# EAGLE design LIC_rack_ZM-01 (EAGLE 7.2.0)
AUTHOR: M. Petrilak; VERSION: 00

## Sheet 1 of 4
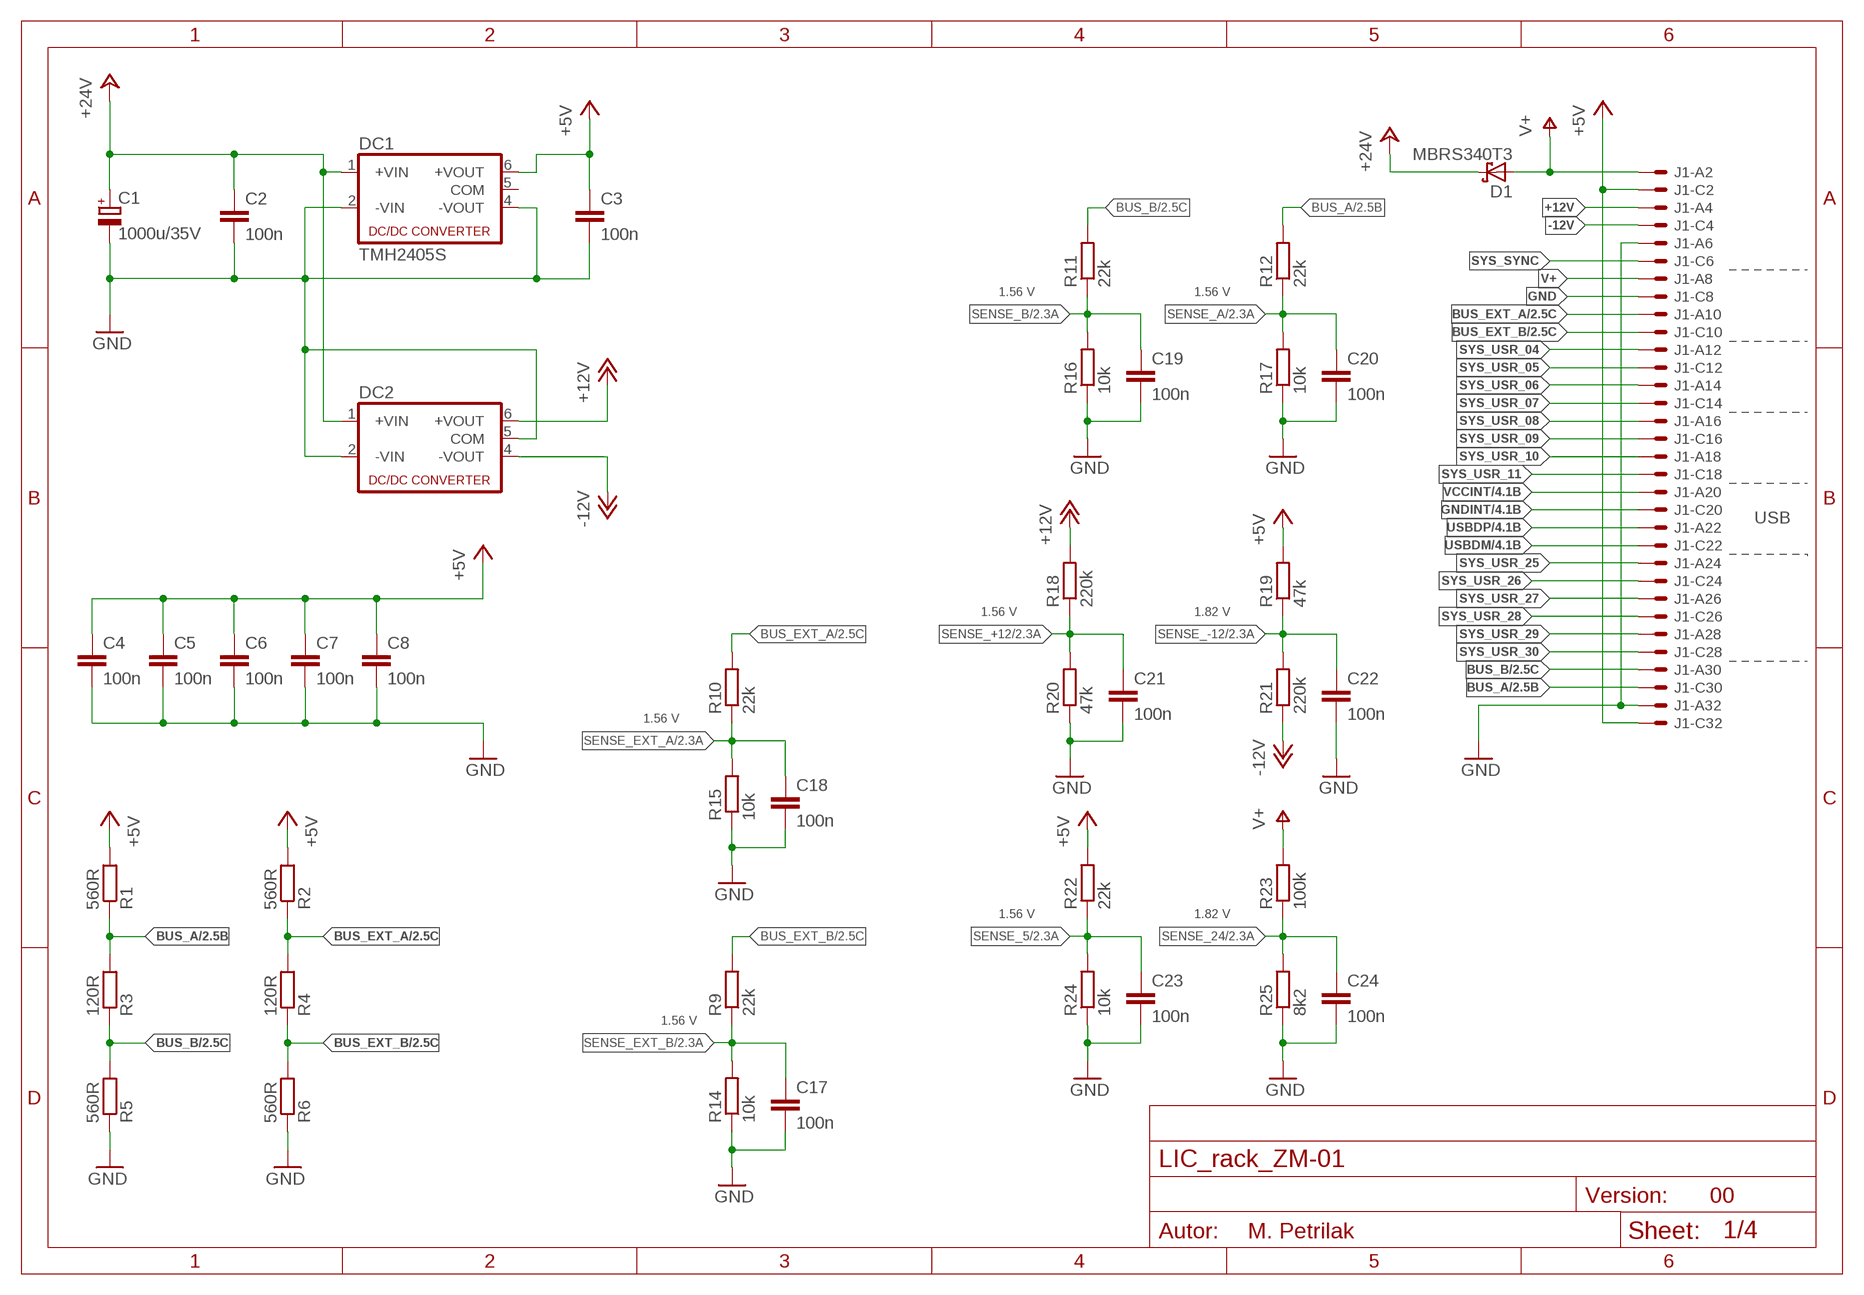
[diagram p0: schematic, sheet 1]

### Parts
C1  1000u/35V  CPOL-EUE5-13X26-LR  [E5-13X26-LR]
C2  100n  C-EUC1206  [C1206]
C3  100n  C-EUC1206  [C1206]
C4  100n  C-EUC1206  [C1206]
C5  100n  C-EUC1206  [C1206]
C6  100n  C-EUC1206  [C1206]
C7  100n  C-EUC1206  [C1206]
C8  100n  C-EUC1206  [C1206]
C17  100n  C-EUC1206  [C1206]
C18  100n  C-EUC1206  [C1206]
C19  100n  C-EUC1206  [C1206]
C20  100n  C-EUC1206  [C1206]
C21  100n  C-EUC1206  [C1206]
C22  100n  C-EUC1206  [C1206]
C23  100n  C-EUC1206  [C1206]
C24  100n  C-EUC1206  [C1206]
D1  MBRS340T3  [SMC]
DC1  TMH2405S  NMA  [NMA]
DC2  NMA  [NMA]
J1  VG32SP  [VG32P]
R1  560R  R-EU_R1206  [R1206]
R2  560R  R-EU_R1206  [R1206]
R3  120R  R-EU_R1206  [R1206]
R4  120R  R-EU_R1206  [R1206]
R5  560R  R-EU_R1206  [R1206]
R6  560R  R-EU_R1206  [R1206]
R9  22k  R-EU_R1206  [R1206]
R10  22k  R-EU_R1206  [R1206]
R11  22k  R-EU_R1206  [R1206]
R12  22k  R-EU_R1206  [R1206]
R14  10k  R-EU_R1206  [R1206]
R15  10k  R-EU_R1206  [R1206]
R16  10k  R-EU_R1206  [R1206]
R17  10k  R-EU_R1206  [R1206]
R18  220k  R-EU_R1206  [R1206]
R19  47k  R-EU_R1206  [R1206]
R20  47k  R-EU_R1206  [R1206]
R21  220k  R-EU_R1206  [R1206]
R22  22k  R-EU_R1206  [R1206]
R23  100k  R-EU_R1206  [R1206]
R24  10k  R-EU_R1206  [R1206]
R25  8k2  R-EU_R1206  [R1206]

### Nets
+5V: C3.1 C4.1 C5.1 C6.1 C7.1 C8.1 DC1.6(+VOUT) J1.C2 J1.C32 R1.2 R2.2 R19.2 R22.2 ; also sheet 2,3,4
+12V: DC2.6(+VOUT) J1.A4 R18.2
+24V: C1.+ C2.1 D1.C DC1.1(+VIN) DC2.1(+VIN)
-12V: DC2.4(-VOUT) J1.C4 R21.1
BUS_A: J1.C30 R1.1 R3.2 R12.2 ; also sheet 2
BUS_B: J1.A30 R3.1 R5.2 R11.2 ; also sheet 2
BUS_EXT_A: J1.A10 R2.1 R4.2 R10.2 ; also sheet 2
BUS_EXT_B: J1.C10 R4.1 R6.2 R9.2 ; also sheet 2
GND: C1.- C2.2 C3.2 C4.2 C5.2 C6.2 C7.2 C8.2 C17.2 C18.2 C19.2 C20.2 C21.2 C22.2 C23.2 C24.2 DC1.2(-VIN) DC1.4(-VOUT) DC2.2(-VIN) DC2.5(COM) J1.A6 J1.A32 J1.C8 R5.1 R6.1 R14.1 R15.1 R16.1 R17.1 R20.1 R24.1 R25.1 ; also sheet 2,3,4
GNDINT [PC]: J1.C20 ; also sheet 4
SENSE_5: C23.1 R22.1 R24.2 ; also sheet 2
SENSE_24: C24.1 R23.1 R25.2 ; also sheet 2
SENSE_+12: C21.1 R18.1 R20.2 ; also sheet 2
SENSE_-12: C22.1 R19.1 R21.2 ; also sheet 2
SENSE_A: C20.1 R12.1 R17.2 ; also sheet 2
SENSE_B: C19.1 R11.1 R16.2 ; also sheet 2
SENSE_EXT_A: C18.1 R10.1 R15.2 ; also sheet 2
SENSE_EXT_B: C17.1 R9.1 R14.2 ; also sheet 2
SYS_SYNC: J1.C6
SYS_USR_04: J1.A12
SYS_USR_05: J1.C12
SYS_USR_06: J1.A14
SYS_USR_07: J1.C14
SYS_USR_08: J1.A16
SYS_USR_09: J1.C16
SYS_USR_10: J1.A18
SYS_USR_11 [PC]: J1.C18
SYS_USR_25: J1.A24
SYS_USR_26 [PC]: J1.C24
SYS_USR_27: J1.A26
SYS_USR_28 [PC]: J1.C26
SYS_USR_29: J1.A28
SYS_USR_30: J1.C28
USBDM [PC]: J1.C22 ; also sheet 4
USBDP [PC]: J1.A22 ; also sheet 4
V+: D1.A J1.A2 J1.A8 R23.2
VCCINT [PC]: J1.A20 ; also sheet 4
Unconnected: DC1.5(COM)

### Notes on the sheet
- 1.56 V | 1.56 V
- USB
- 1.56 V | 1.82 V
- 1.56 V
- 1.56 V | 1.82 V
- 1.56 V

## Sheet 2 of 4
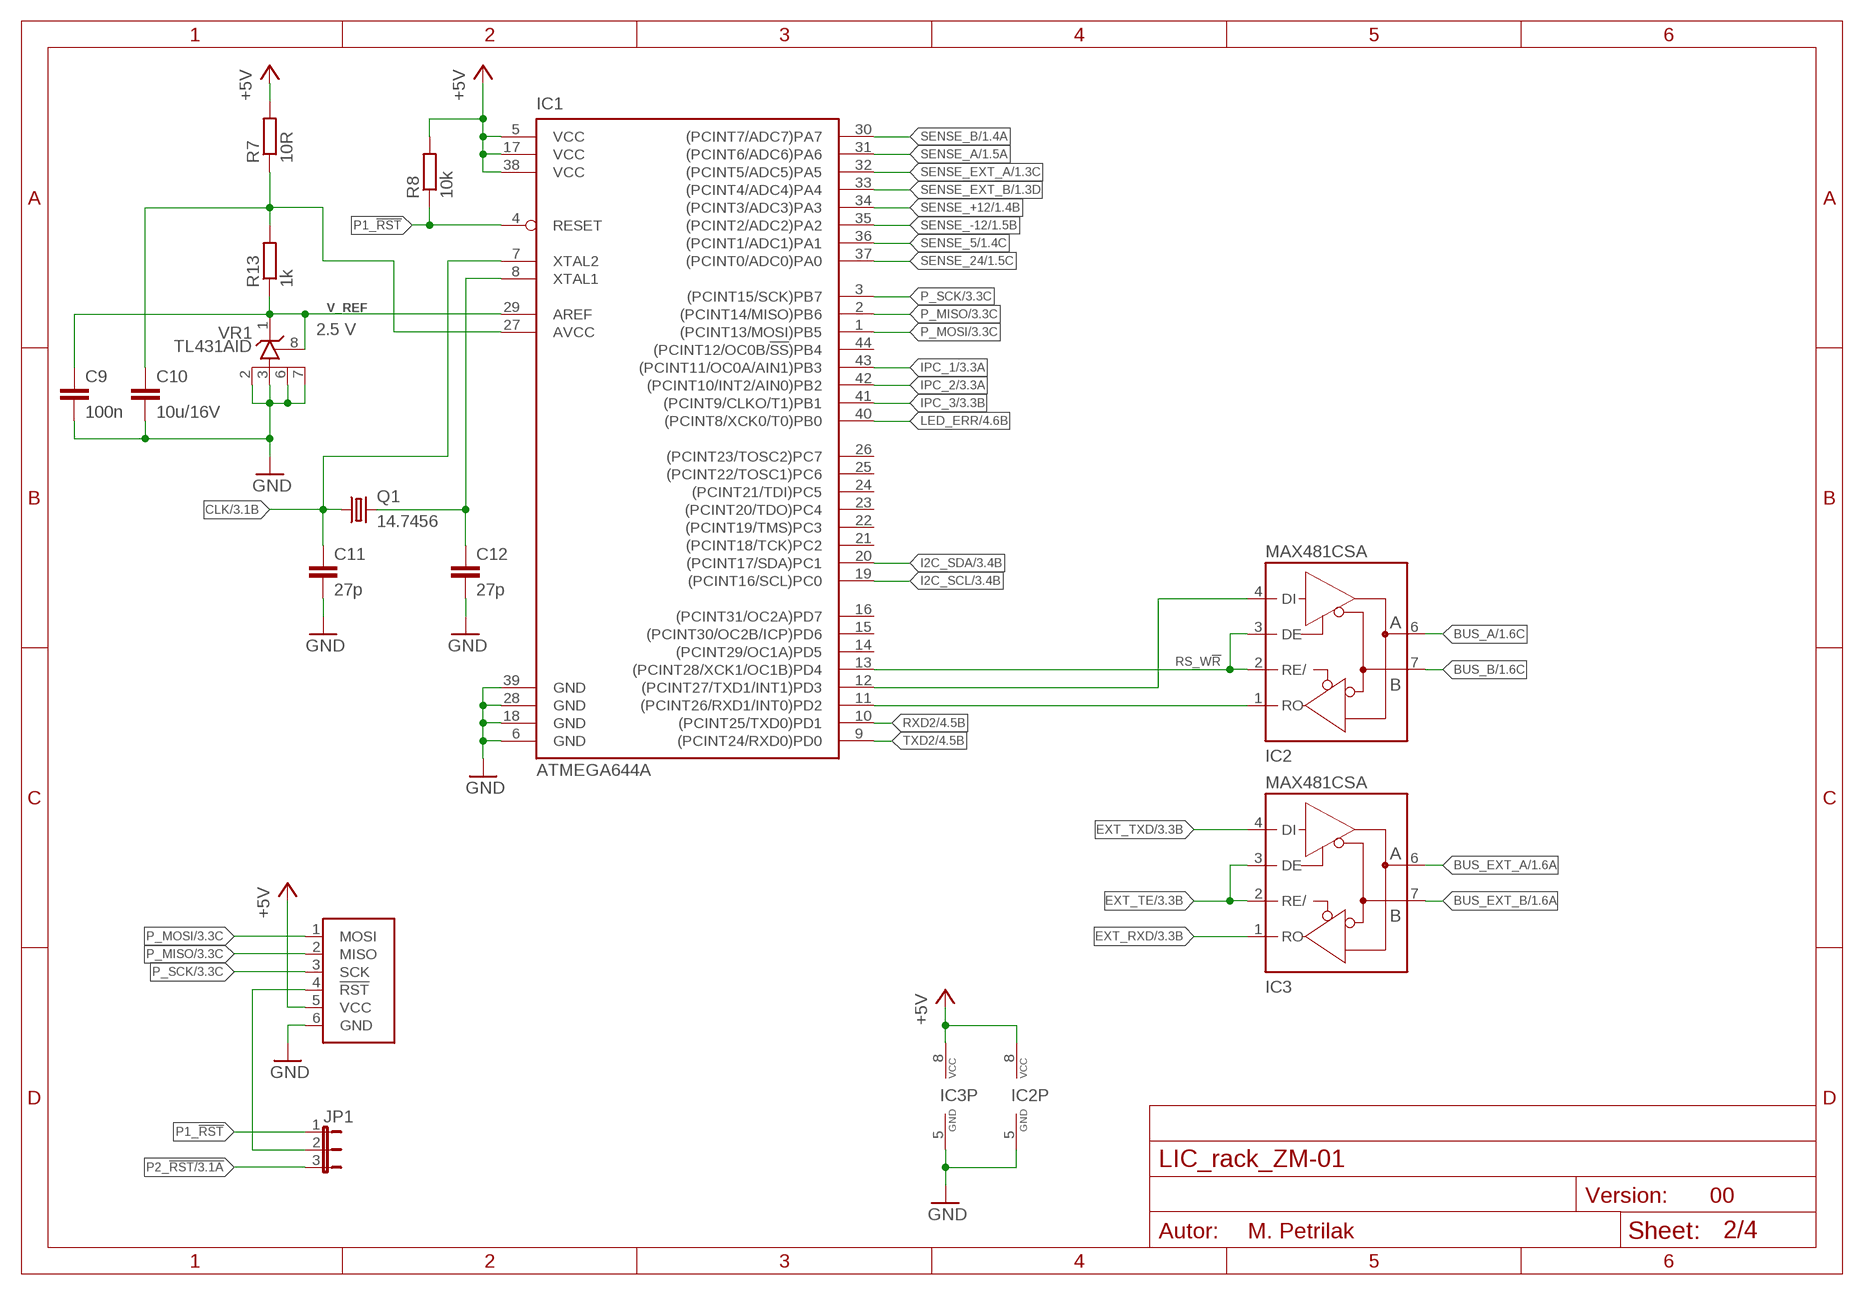
[diagram p1: schematic, sheet 2]

### Parts
C9  100n  C-EUC1206  [C1206]
C10  10u/16V  C-EUC1206  [C1206]
C11  27p  C-EUC0805  [C0805]
C12  27p  C-EUC0805  [C0805]
IC1  ATMEGA644A  [TQFP44]
IC2  MAX481CSA  [SO08]
IC3  MAX481CSA  [SO08]
JP1  JP2E  [JP2]
Q1  14.7456  XTAL  [HC49U70]
R7  10R  R-EU_R1206  [R1206]
R8  10k  R-EU_R1206  [R1206]
R13  1k  R-EU_R1206  [R1206]
U1  ATPROG-V  [6410-06]
VR1  TL431AID  TL431-SMD  [SO-08]

### Nets
!RST: JP1.2 U1.4(!RST)
+5V: IC1.5(VCC) IC1.17(VCC) IC1.38(VCC) IC2.8(VCC) IC3.8(VCC) R7.2 R8.2 U1.5(VCC) ; also sheet 1,3,4
+5V_AD: C10.1 IC1.27(AVCC) R7.1 R13.2
BUS_A: IC2.6(A) ; also sheet 1
BUS_B: IC2.7(B) ; also sheet 1
BUS_EXT_A: IC3.6(A) ; also sheet 1
BUS_EXT_B: IC3.7(B) ; also sheet 1
CLK: C11.1 IC1.7(XTAL2) Q1.1 ; also sheet 3
EXT_RXD: IC3.1(RO) ; also sheet 3
EXT_TE: IC3.2(RE/) IC3.3(DE) ; also sheet 3
EXT_TXD: IC3.4(DI) ; also sheet 3
GND: C9.2 C10.2 C11.2 C12.2 IC1.6(GND) IC1.18(GND) IC1.28(GND) IC1.39(GND) IC2.5(GND) IC3.5(GND) U1.6(GND) VR1.2(A3) VR1.3(A2) VR1.6(A1) VR1.7(A) ; also sheet 1,3,4
I2C_SCL: IC1.19((PCINT16/SCL)PC0) ; also sheet 3
I2C_SDA: IC1.20((PCINT17/SDA)PC1) ; also sheet 3
IPC_1: IC1.43((PCINT11/OC0A/AIN1)PB3) ; also sheet 3
IPC_2: IC1.42((PCINT10/INT2/AIN0)PB2) ; also sheet 3
IPC_3: IC1.41((PCINT9/CLKO/T1)PB1) ; also sheet 3
LED_ERR: IC1.40((PCINT8/XCK0/T0)PB0) ; also sheet 4
N$2: C12.1 IC1.8(XTAL1) Q1.2
P1_!RST: IC1.4(RESET) JP1.1 R8.1
P2_!RST: JP1.3 ; also sheet 3
P_MISO: IC1.2((PCINT14/MISO)PB6) U1.2(MISO) ; also sheet 3
P_MOSI: IC1.1((PCINT13/MOSI)PB5) U1.1(MOSI) ; also sheet 3
P_SCK: IC1.3((PCINT15/SCK)PB7) U1.3(SCK) ; also sheet 3
RS_RXD: IC1.11((PCINT26/RXD1/INT0)PD2) IC2.1(RO)
RS_TXD: IC1.12((PCINT27/TXD1/INT1)PD3) IC2.4(DI)
RS_W!R!: IC1.13((PCINT28/XCK1/OC1B)PD4) IC2.2(RE/) IC2.3(DE)
RXD2: IC1.10((PCINT25/TXD0)PD1) ; also sheet 4
SENSE_5: IC1.36((PCINT1/ADC1)PA1) ; also sheet 1
SENSE_24: IC1.37((PCINT0/ADC0)PA0) ; also sheet 1
SENSE_+12: IC1.34((PCINT3/ADC3)PA3) ; also sheet 1
SENSE_-12: IC1.35((PCINT2/ADC2)PA2) ; also sheet 1
SENSE_A: IC1.31((PCINT6/ADC6)PA6) ; also sheet 1
SENSE_B: IC1.30((PCINT7/ADC7)PA7) ; also sheet 1
SENSE_EXT_A: IC1.32((PCINT5/ADC5)PA5) ; also sheet 1
SENSE_EXT_B: IC1.33((PCINT4/ADC4)PA4) ; also sheet 1
TXD2: IC1.9((PCINT24/RXD0)PD0) ; also sheet 4
V_REF: C9.1 IC1.29(AREF) R13.1 VR1.1(C) VR1.8(R)
Unconnected: IC1.14((PCINT29/OC1A)PD5) IC1.15((PCINT30/OC2B/ICP)PD6) IC1.16((PCINT31/OC2A)PD7) IC1.21((PCINT18/TCK)PC2) IC1.22((PCINT19/TMS)PC3) IC1.23((PCINT20/TDO)PC4) IC1.24((PCINT21/TDI)PC5) IC1.25((PCINT22/TOSC1)PC6) IC1.26((PCINT23/TOSC2)PC7) IC1.44((PCINT12/OC0B/!SS!)PB4)

### Notes on the sheet
- 2.5 V

## Sheet 3 of 4
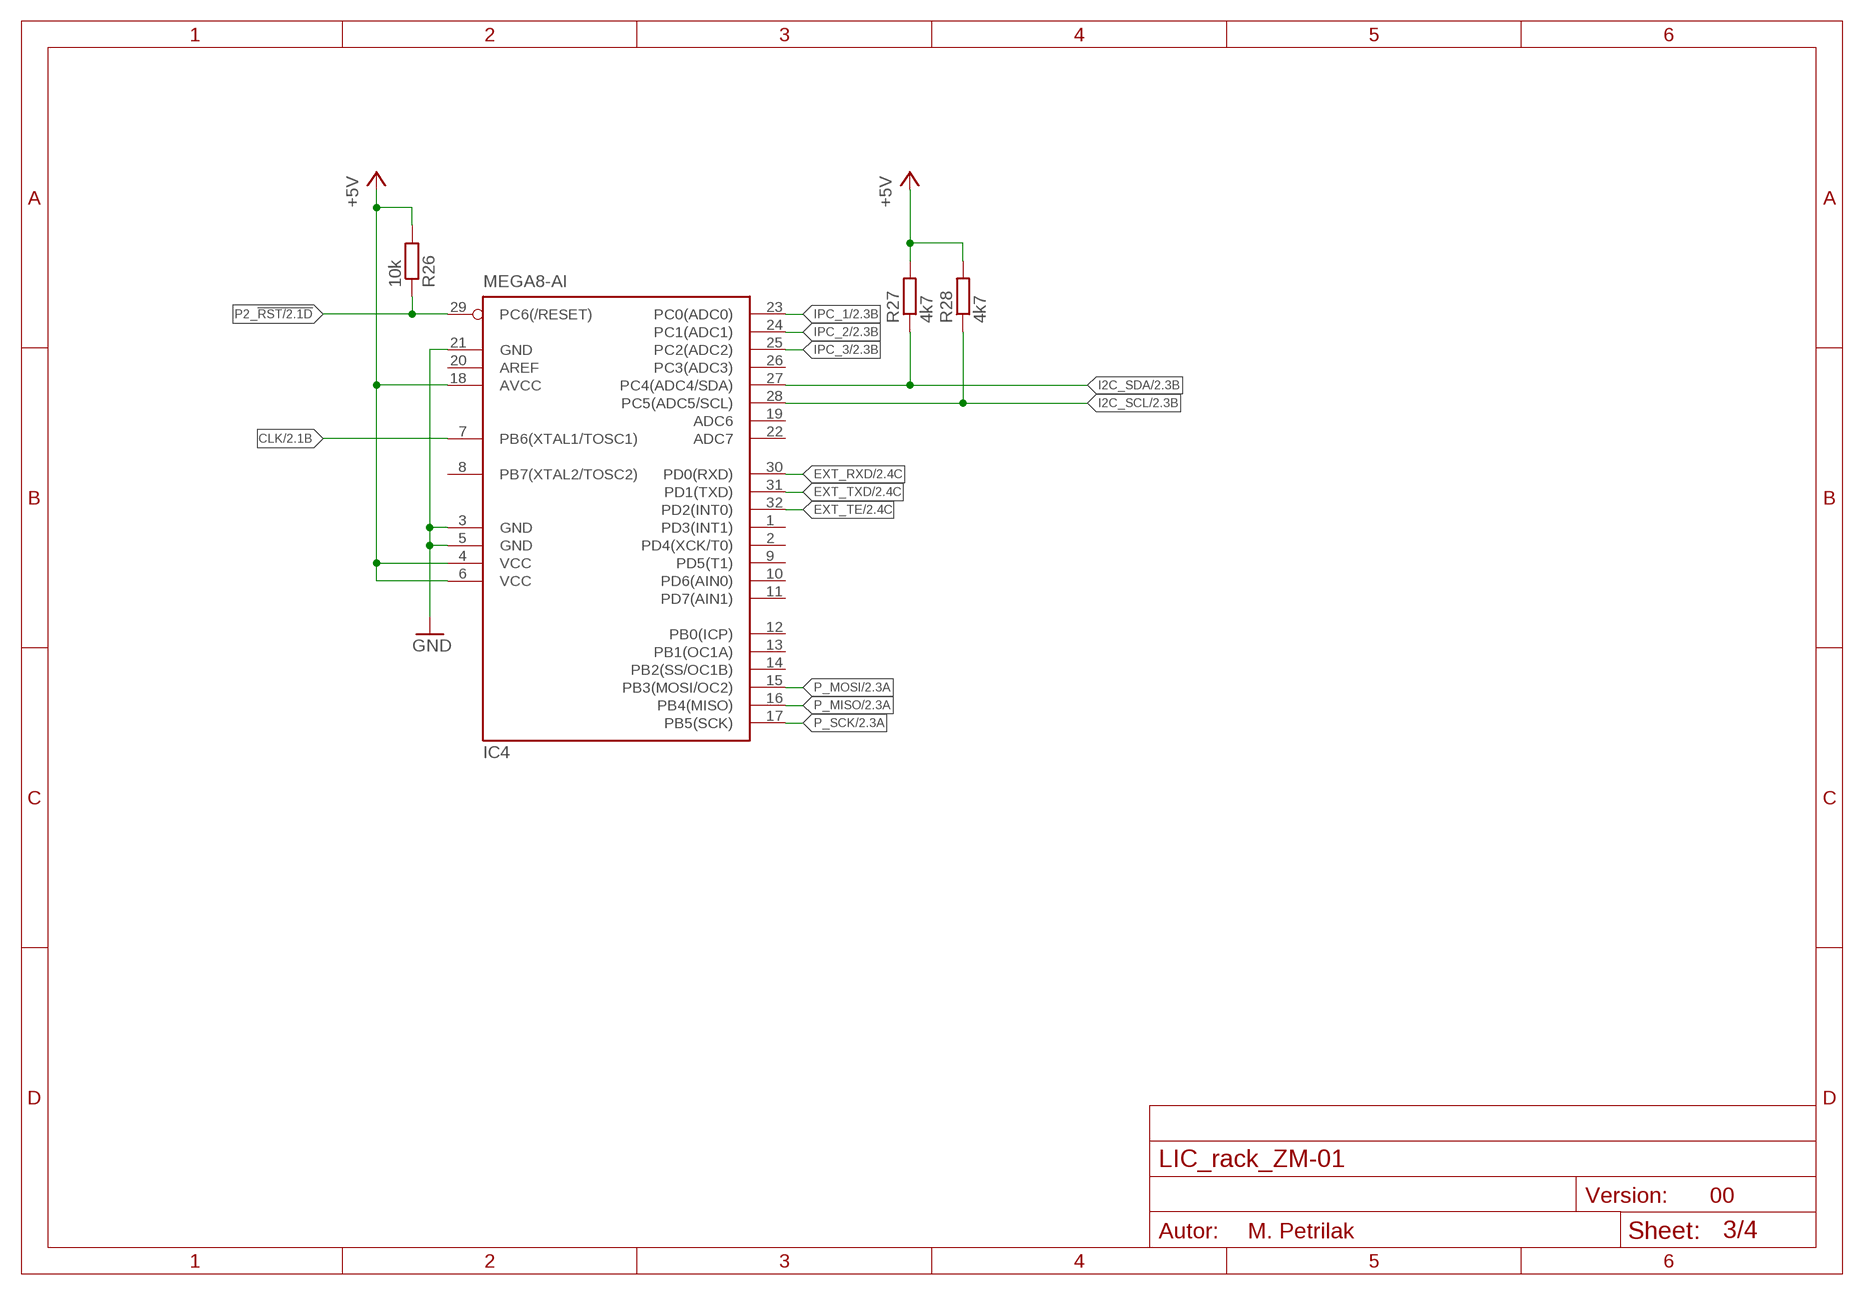
[diagram p2: schematic, sheet 3]

### Parts
IC4  MEGA8-AI  [TQFP32-08]
R26  10k  R-EU_R1206  [R1206]
R27  4k7  R-EU_R1206  [R1206]
R28  4k7  R-EU_R1206  [R1206]

### Nets
+5V: IC4.4(VCC) IC4.6(VCC) IC4.18(AVCC) R26.2 R27.2 R28.2 ; also sheet 1,2,4
CLK: IC4.7(PB6(XTAL1/TOSC1)) ; also sheet 2
EXT_RXD: IC4.30(PD0(RXD)) ; also sheet 2
EXT_TE: IC4.32(PD2(INT0)) ; also sheet 2
EXT_TXD: IC4.31(PD1(TXD)) ; also sheet 2
GND: IC4.3(GND) IC4.5(GND) IC4.21(GND) ; also sheet 1,2,4
I2C_SCL: IC4.28(PC5(ADC5/SCL)) R28.1 ; also sheet 2
I2C_SDA: IC4.27(PC4(ADC4/SDA)) R27.1 ; also sheet 2
IPC_1: IC4.23(PC0(ADC0)) ; also sheet 2
IPC_2: IC4.24(PC1(ADC1)) ; also sheet 2
IPC_3: IC4.25(PC2(ADC2)) ; also sheet 2
P2_!RST: IC4.29(PC6(/RESET)) R26.1 ; also sheet 2
P_MISO: IC4.16(PB4(MISO)) ; also sheet 2
P_MOSI: IC4.15(PB3(MOSI/OC2)) ; also sheet 2
P_SCK: IC4.17(PB5(SCK)) ; also sheet 2
Unconnected: IC4.1(PD3(INT1)) IC4.2(PD4(XCK/T0)) IC4.8(PB7(XTAL2/TOSC2)) IC4.9(PD5(T1)) IC4.10(PD6(AIN0)) IC4.11(PD7(AIN1)) IC4.12(PB0(ICP)) IC4.13(PB1(OC1A)) IC4.14(PB2(SS/OC1B)) IC4.19(ADC6) IC4.20(AREF) IC4.22(ADC7) IC4.26(PC3(ADC3))

## Sheet 4 of 4
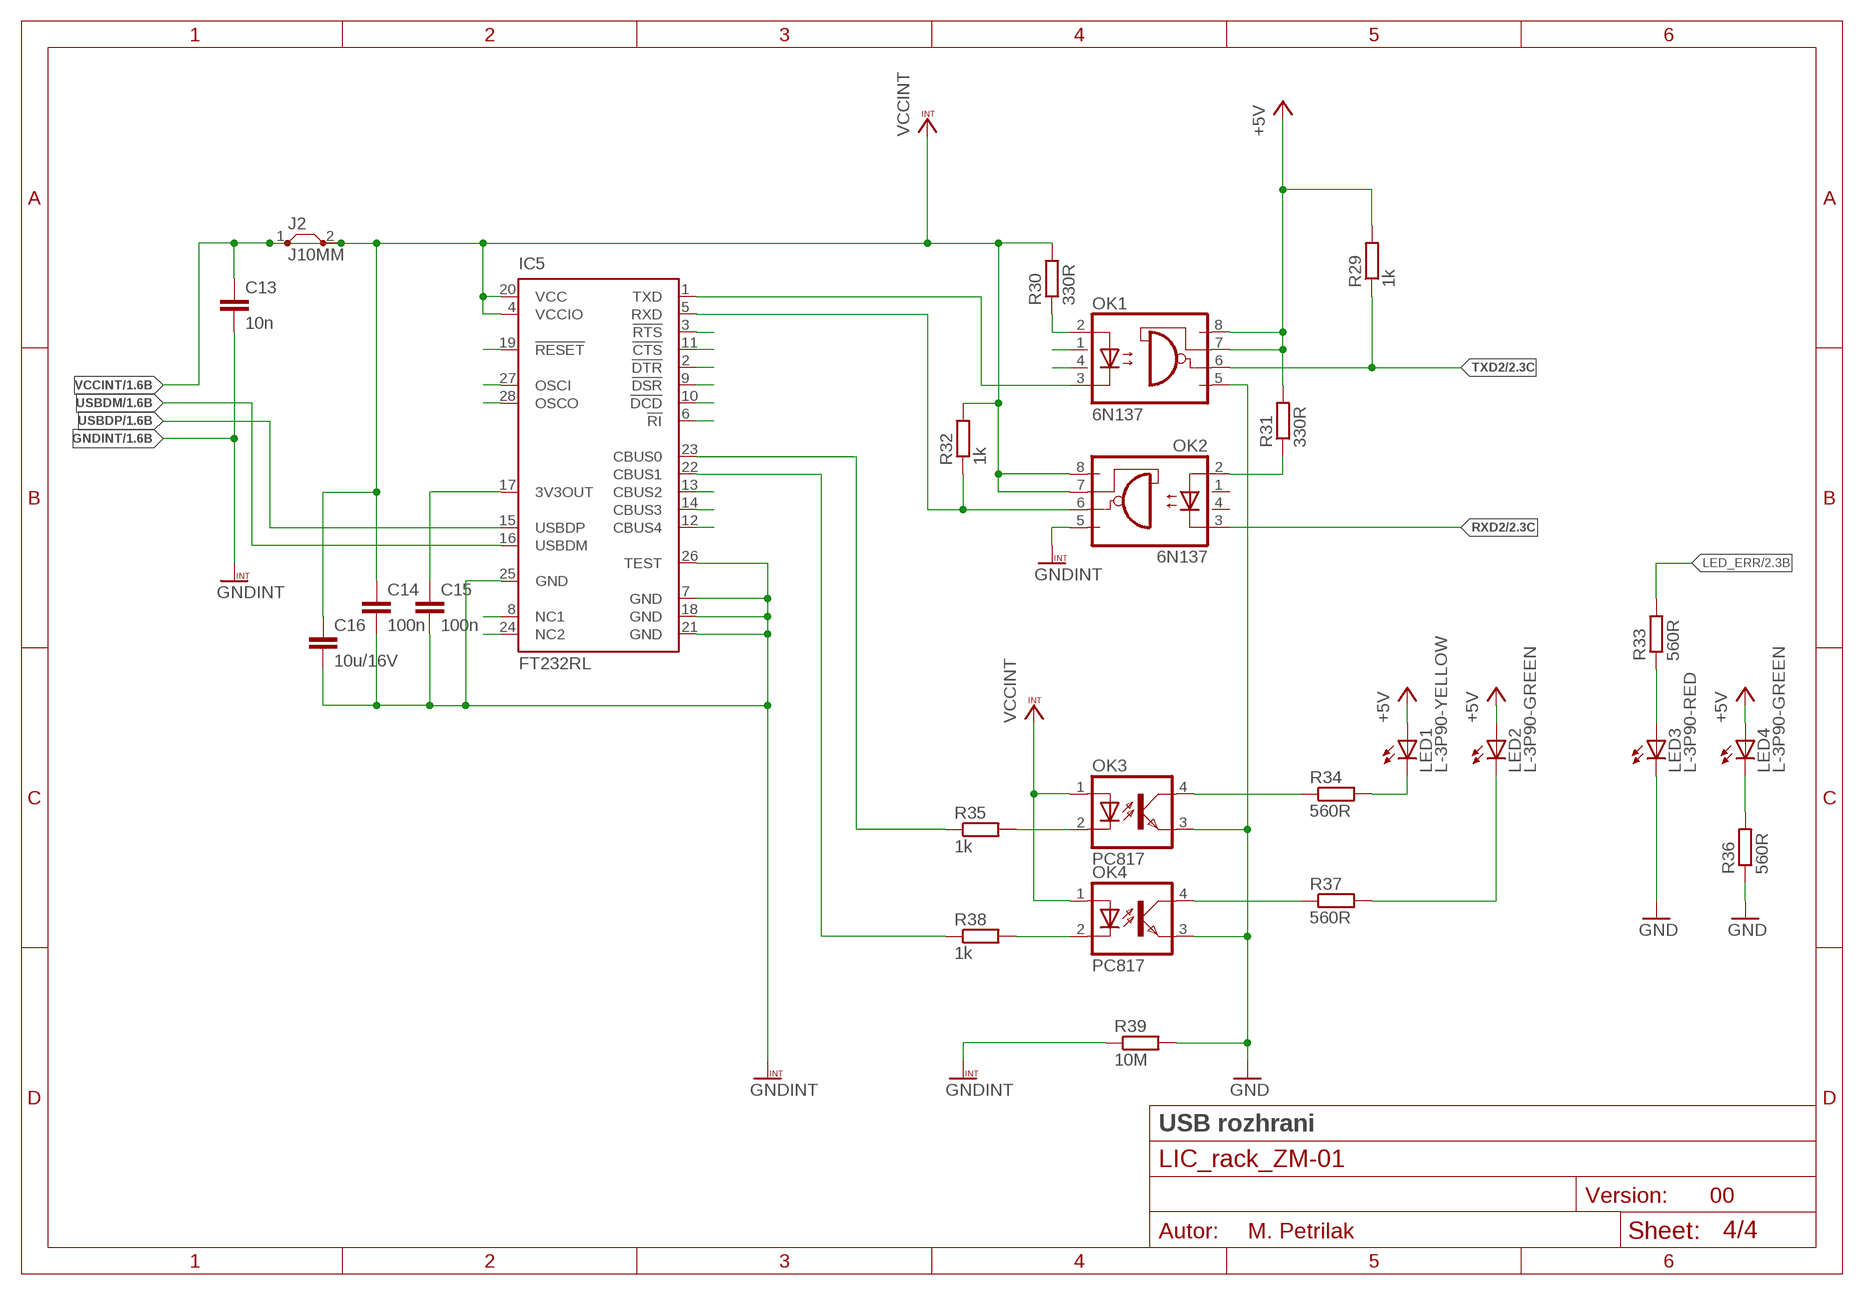
[diagram p3: schematic, sheet 4]

### Parts
C13  10n  C-EUC0805  [C0805]
C14  100n  C-EUC1206  [C1206]
C15  100n  C-EUC1206  [C1206]
C16  10u/16V  C-EUC1206  [C1206]
IC5  FT232RL  [SSOP28]
J2  J10MM  [10]
LED1  L-3P90-YELLOW  [L-3P90]
LED2  L-3P90-GREEN  [L-3P90]
LED3  L-3P90-RED  [L-3P90]
LED4  L-3P90-GREEN  [L-3P90]
OK1  6N137  [DIL08]
OK2  6N137  [DIL08]
OK3  PC817  [DIL04]
OK4  PC817  [DIL04]
R29  1k  R-EU_R1206  [R1206]
R30  330R  R-EU_R1206  [R1206]
R31  330R  R-EU_R1206  [R1206]
R32  1k  R-EU_R1206  [R1206]
R33  560R  R-EU_R1206  [R1206]
R34  560R  R-EU_R1206  [R1206]
R35  1k  R-EU_R1206  [R1206]
R36  560R  R-EU_R1206  [R1206]
R37  560R  R-EU_R1206  [R1206]
R38  1k  R-EU_R1206  [R1206]
R39  10M  R-EU_R1206  [R1206]

### Nets
3V3 [PC]: C15.1 IC5.17(3V3OUT)
+5V: LED1.A LED2.A LED4.A OK1.7(VE) OK1.8(VCC) R29.2 R31.2 ; also sheet 1,2,3
GND: LED3.K(C) OK1.5(GND) OK3.3(EMIT) OK4.3(EMIT) R36.1 R39.2 ; also sheet 1,2,3
GNDINT [PC]: C13.2 C14.2 C15.2 C16.2 IC5.7(GND) IC5.18(GND) IC5.21(GND) IC5.25(GND) IC5.26(TEST) OK2.5(GND) R39.1 ; also sheet 1
LED_ERR: R33.2 ; also sheet 2
N$1: LED4.K(C) R36.2
N$3 [PC]: IC5.22(CBUS1) R38.1
N$4 [PC]: IC5.14(CBUS3)
N$6 [PC]: OK4.2(C) R38.2
N$7 [PC]: OK3.2(C) R35.2
N$9: LED3.A R33.1
N$12 [PC]: IC5.19(!RESET)
N$13: OK2.2(A) R31.1
N$16: OK4.4(COL) R37.1
N$17: LED2.K(C) R37.2
N$21 [PC]: OK1.2(A) R30.1
N$23: OK3.4(COL) R34.1
N$24 [PC]: IC5.23(CBUS0) R35.1
N$25 [PC]: IC5.27(OSCI)
N$26: LED1.K(C) R34.2
N$29 [PC]: IC5.28(OSCO)
N$30 [PC]: IC5.3(!RTS)
N$31 [PC]: IC5.11(!CTS)
N$32 [PC]: IC5.2(!DTR)
N$33 [PC]: IC5.9(!DSR)
N$34 [PC]: IC5.10(!DCD)
N$35 [PC]: IC5.6(!RI)
N$36 [PC]: IC5.12(CBUS4)
N$37 [PC]: IC5.13(CBUS2)
N$38 [PC]: IC5.8(NC1)
N$39 [PC]: IC5.24(NC2)
N$42 [PC]: OK1.1(A1)
N$43 [PC]: OK1.4(A2)
RXD1 [PC]: IC5.5(RXD) OK2.6(VO) R32.1
RXD2: OK2.3(C) ; also sheet 2
TXD1 [PC]: IC5.1(TXD) OK1.3(C)
TXD2: OK1.6(VO) R29.1 ; also sheet 2
USBDM [PC]: IC5.16(USBDM) ; also sheet 1
USBDP [PC]: IC5.15(USBDP) ; also sheet 1
VCCINT [PC]: C13.1 C14.1 C16.1 IC5.4(VCCIO) IC5.20(VCC) J2.1 J2.2 OK2.7(VE) OK2.8(VCC) OK3.1(A) OK4.1(A) R30.2 R32.2 ; also sheet 1
Unconnected: OK2.1(A1) OK2.4(A2)

### Notes on the sheet
- USB rozhrani

## Library data of the parts
C1 = rcl:CPOL-EU: POLARIZED CAPACITOR, European symbol
C2-C24 = rcl:C-EU: CAPACITOR, European symbol
D1 = diode:MBRS340T3
DC1 DC2 = dc-dc-converter:NMA: DC-DC CONVERTER
IC1 = atmel:ATMEGA644: 8-bit Microcontroller with 64K Bytes In-System Programmable Flash Source: http://www.atmel.com/dyn/resources/prod_documents/doc2593.pdf
IC2 IC3 = maxim:MAX481CSA: RS485 TRANSEIVER
IC4 = atmel:MEGA8: MICROCONTROLLER 8 Kbytes FLASH, 1 kbytes SRAM, 512 bytes EEPROM, USART, 6-channel 10 bit ADC, 2-channel 8 bit ADC Pin compatible with Atmega48, ATMega88, ATMega168 Source: avr.lbr
IC5 = ftdichip:FT232R: Source: http://www.ftdichip.com/Documents/DataSheets/DS_FT232R_v104.pdf
J1 = 19inch:VG32S: PCB EUROCARD, 32-pin type C/AC, 5.08 mm
J2 = jumper:J: Bridge
JP1 = jumper:JP2E: JUMPER
LED1-LED4 = led:L-3P90
OK1 OK2 = optocoupler:6N137: MOTOROLA OPTO COUPLER
OK3 OK4 = optocoupler:PC817: SHARP OPTO COUPLER
Q1 = crystal:XTAL
R1-R39 = rcl:R-EU_: RESISTOR, European symbol
U1 = con-molex:ATPROG
VR1 = v-reg:TL431-SMD

## Net classes
1 PC: clearance 2 mm to class 0

## Board
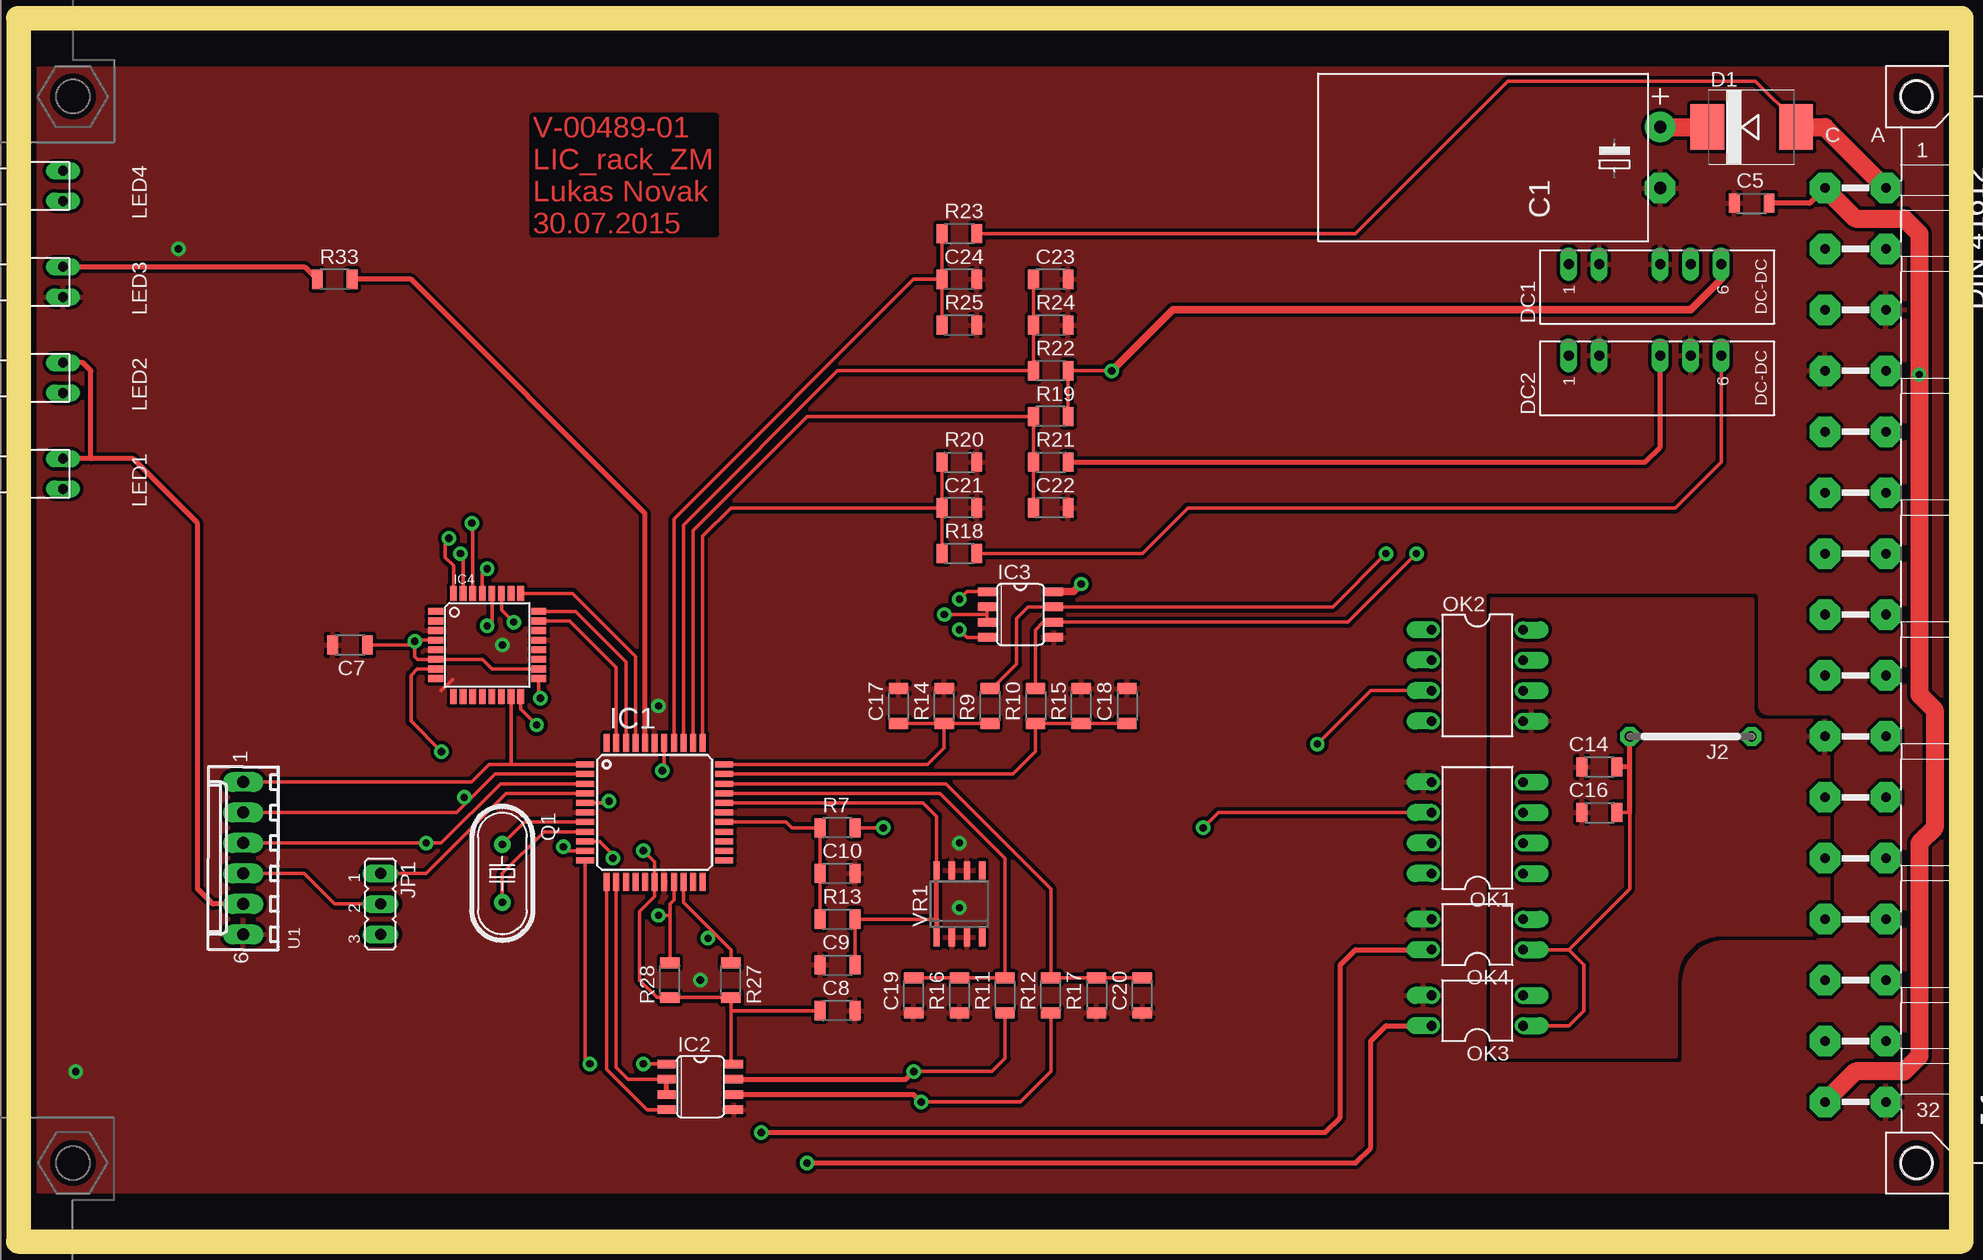
[diagram p4: board, top side]
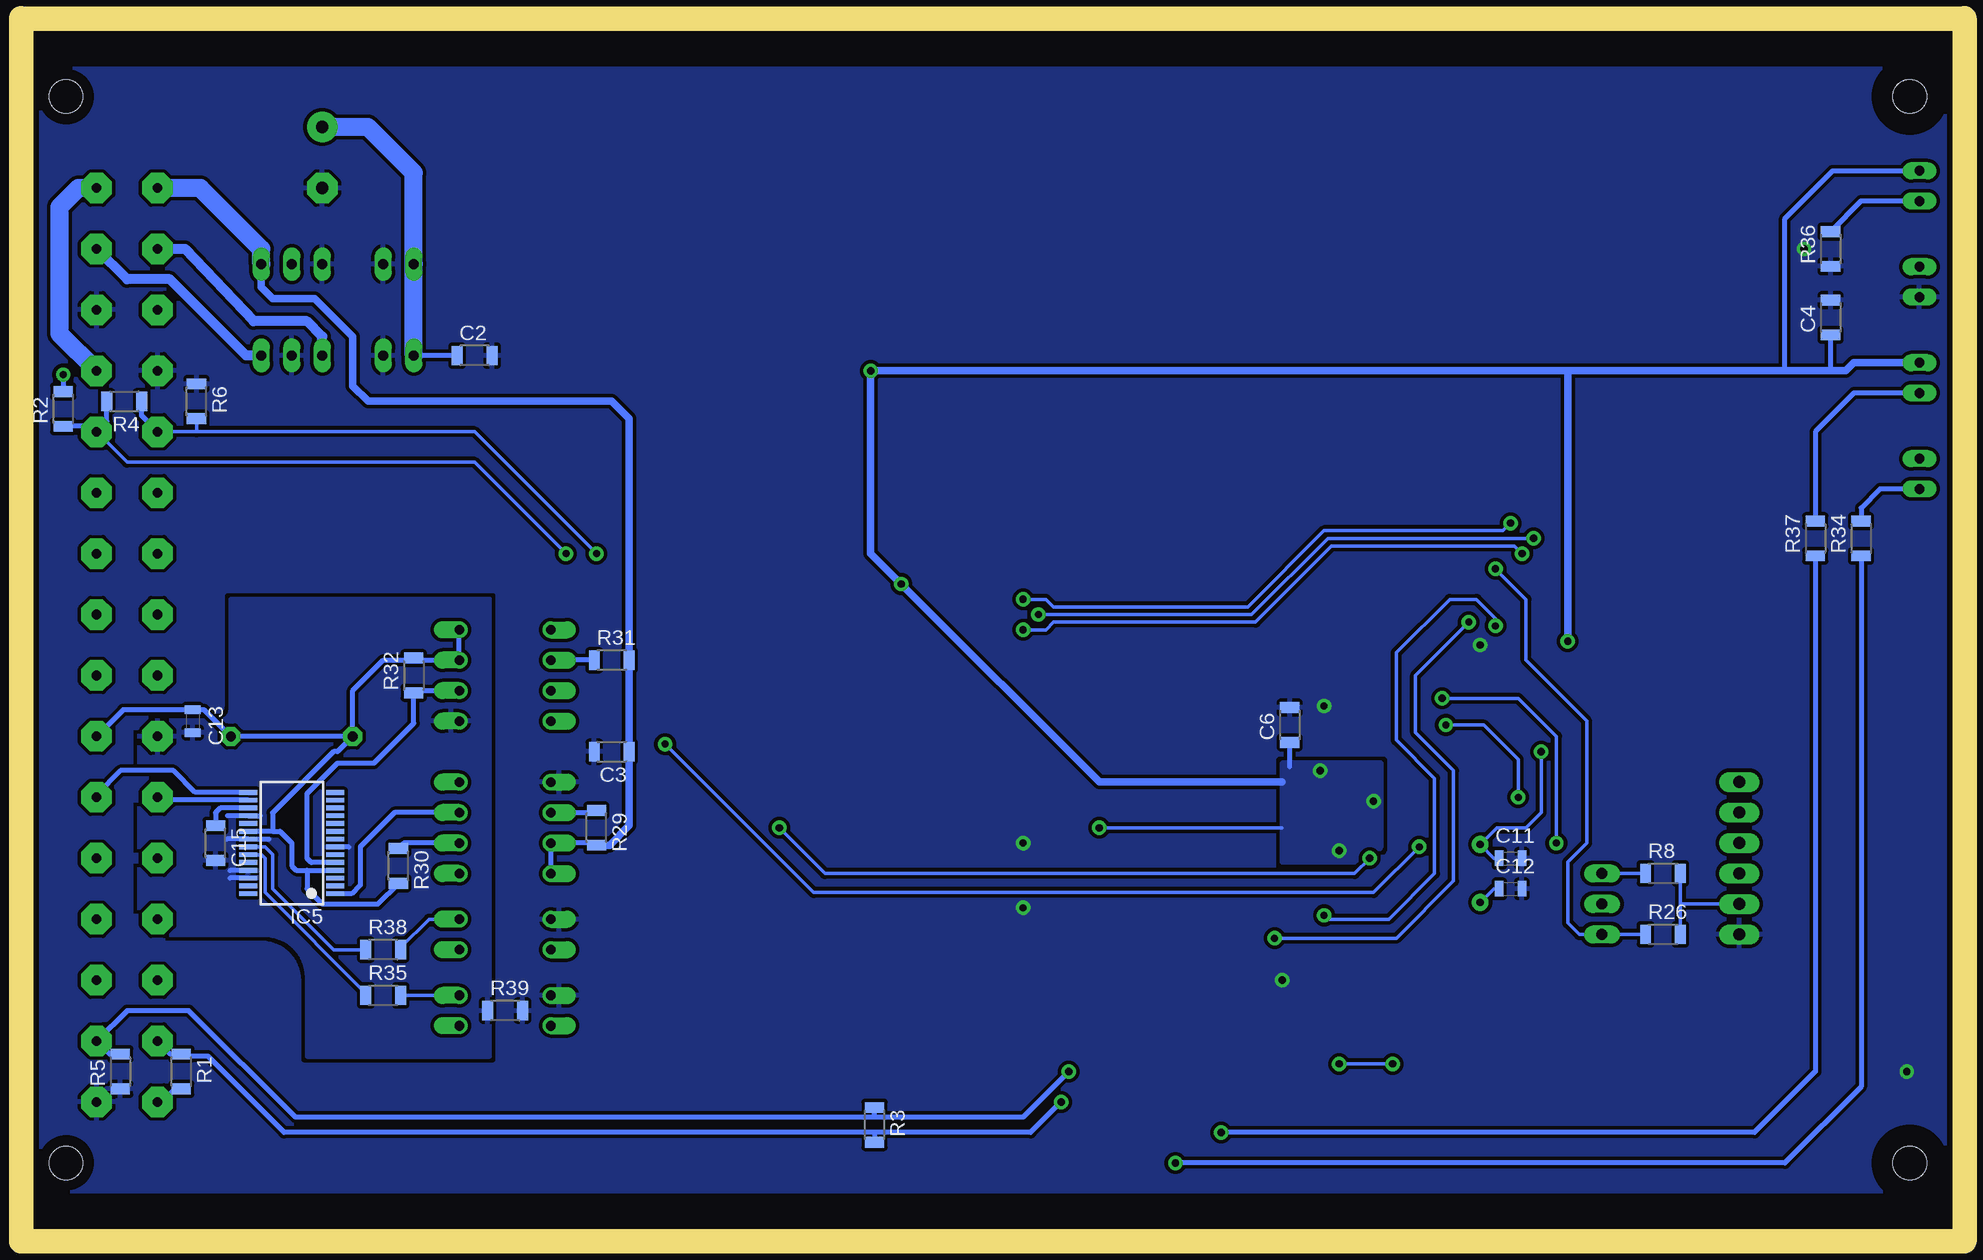
[diagram p5: board, bottom side, seen from below]

Size 160 x 100 mm. Coordinates in mm from the lower left corner, seen from the top.
Copper layers (1*16): Top 0.04mm / dielectric 1.5mm / Bottom 0.04mm
Design rules "mucha_navrh": minimum track width 0.2mm, minimum drill 0.6mm, track to track 0.3mm, track to pad 0.3mm, pad to pad 0.3mm, via to via 0.3mm, smd to smd 0mil, copper to edge 0.5mm, drill to drill 0.5mm, minimum pad ring 0.3mm, minimum via ring 0.3mm, stop-mask expansion 0.1mm, vias tented up to drill 0.5mm, thermal gap 0.3mm

### Footprints (pad centres in the part's own frame; a part is rotated, then mirrored left to right if it is on the bottom)
E5-13X26-LR = drill 1.016 pad 2.54: + -2.54,0 | drill 1.016 pad 2.54 octagon: - 2.54,0
C1206 = smd 0.9 x 1.6: 1 -1.45,0; 2 1.45,0
C0805 = smd 0.7 x 1.3: 1 -0.95,0; 2 0.95,0
SMC = smd 2.8 x 3.8: A 3.7,0; C -3.7,0
NMA = drill 0.813 long: 1 0,6.35; 2 0,3.81; 4 0,-1.27; 5 0,-3.81; 6 0,-6.35
TQFP44 = smd 1.5 x 0.5: 1 -5.8,4; 2 -5.8,3.2; 3 -5.8,2.4; 4 -5.8,1.6; 5 -5.8,0.8; 6 -5.8,0; 7 -5.8,-0.8; 8 -5.8,-1.6; 9 -5.8,-2.4; 10 -5.8,-3.2; 11 -5.8,-4; 23 5.8,-4; 24 5.8,-3.2; 25 5.8,-2.4; 26 5.8,-1.6; 27 5.8,-0.8; 28 5.8,0; 29 5.8,0.8; 30 5.8,1.6; 31 5.8,2.4; 32 5.8,3.2; 33 5.8,4 | smd 0.5 x 1.5: 12 -4,-5.8; 13 -3.2,-5.8; 14 -2.4,-5.8; 15 -1.6,-5.8; 16 -0.8,-5.8; 17 0,-5.8; 18 0.8,-5.8; 19 1.6,-5.8; 20 2.4,-5.8; 21 3.2,-5.8; 22 4,-5.8; 34 4,5.8; 35 3.2,5.8; 36 2.4,5.8; 37 1.6,5.8; 38 0.8,5.8; 39 0,5.8; 40 -0.8,5.8; 41 -1.6,5.8; 42 -2.4,5.8; 43 -3.2,5.8; 44 -4,5.8
SO08 = smd 0.72 x 1.5: 1 -1.905,-2.8; 2 -0.635,-2.8; 3 0.635,-2.8; 4 1.905,-2.8; 5 1.905,2.8; 6 0.635,2.8; 7 -0.635,2.8; 8 -1.905,2.8
TQFP32-08 = smd 1.27 x 0.559: 1 -4.293,2.8; 2 -4.293,2; 3 -4.293,1.2; 4 -4.293,0.4; 5 -4.293,-0.4; 6 -4.293,-1.2; 7 -4.293,-2; 8 -4.293,-2.8; 17 4.293,-2.8; 18 4.293,-2; 19 4.293,-1.2; 20 4.293,-0.4; 21 4.293,0.4; 22 4.293,1.2; 23 4.293,2; 24 4.293,2.8 | smd 0.559 x 1.27: 9 -2.8,-4.293; 10 -2,-4.293; 11 -1.2,-4.293; 12 -0.4,-4.293; 13 0.4,-4.293; 14 1.2,-4.293; 15 2,-4.293; 16 2.8,-4.293; 25 2.8,4.293; 26 2,4.293; 27 1.2,4.293; 28 0.4,4.293; 29 -0.4,4.293; 30 -1.2,4.293; 31 -2,4.293; 32 -2.8,4.293
SSOP28 = smd 0.4 x 1.5: 1 -4.225,-3.625; 2 -3.575,-3.625; 3 -2.925,-3.625; 4 -2.275,-3.625; 5 -1.625,-3.625; 6 -0.975,-3.625; 7 -0.325,-3.625; 8 0.325,-3.625; 9 0.975,-3.625; 10 1.625,-3.625; 11 2.275,-3.625; 12 2.925,-3.625; 13 3.575,-3.625; 14 4.225,-3.625; 15 4.225,3.625; 16 3.575,3.625; 17 2.925,3.625; 18 2.275,3.625; 19 1.625,3.625; 20 0.975,3.625; 21 0.325,3.625; 22 -0.325,3.625; 23 -0.975,3.625; 24 -1.625,3.625; 25 -2.275,3.625; 26 -2.925,3.625; 27 -3.575,3.625; 28 -4.225,3.625
VG32P = drill 0.8 pad 2.54 octagon: A2 154.7,36.83; A4 154.7,31.75; A6 154.7,26.67; A8 154.7,21.59; A10 154.7,16.51; A12 154.7,11.43; A14 154.7,6.35; A16 154.7,1.27; A18 154.7,-3.81; A20 154.7,-8.89; A22 154.7,-13.97; A24 154.7,-19.05; A26 154.7,-24.13; A28 154.7,-29.21; A30 154.7,-34.29; A32 154.7,-39.37; C2 149.62,36.83; C4 149.62,31.75; C6 149.62,26.67; C8 149.62,21.59; C10 149.62,16.51; C12 149.62,11.43; C14 149.62,6.35; C16 149.62,1.27; C18 149.62,-3.81; C20 149.62,-8.89; C22 149.62,-13.97; C24 149.62,-19.05; C26 149.62,-24.13; C28 149.62,-29.21; C30 149.62,-34.29; C32 149.62,-39.37 | hole 2.794: 3.57,44.45; 3.57,-44.45; 157.24,44.45; 157.24,-44.45; 3.57,44.45; 3.57,-44.45; 157.24,44.45; 157.24,-44.45
10 = drill 0.813 pad 1.6 octagon: 1 -5.08,0; 2 5.08,0
JP2 = drill 0.914 long: 1 -2.54,0; 2 0,0; 3 2.54,0
L-3P90 = drill 0.813 long: A 4.7,1.27; K 4.7,-1.27
DIL08 = drill 0.8 pad 1.4 offset: 1 -3.81,-3.81; 2 -1.27,-3.81; 3 1.27,-3.81; 4 3.81,-3.81; 5 3.81,3.81; 6 1.27,3.81; 7 -1.27,3.81; 8 -3.81,3.81
DIL04 = drill 0.8 pad 1.4 offset: 1 -1.27,-3.81; 2 1.27,-3.81; 3 1.27,3.81; 4 -1.27,3.81
HC49U70 = drill 0.6 pad 1.4: 1 -2.413,0; 2 2.413,0
R1206 = smd 0.9 x 1.6: 1 -1.45,0; 2 1.45,0
6410-06 = drill 1.016 long: 1 6.35,0; 2 3.81,0; 3 1.27,0; 4 -1.27,0; 5 -3.81,0; 6 -6.35,0
SO-08 = smd 0.53 x 1.5: 1 -1.905,-2.8; 2 -0.635,-2.8; 3 0.635,-2.8; 4 1.905,-2.8; 5 1.905,2.8; 6 0.635,2.8; 7 -0.635,2.8; 8 -1.905,2.8

### Placement (x,y rotation side)
C1  135.89,89.37 270 top
C2  123.19,72.86 0 bottom
C3  111.76,39.84 180 bottom
C4  10.16,76.03 90 bottom
C5  143.51,85.56 180 top
C6  55.24,42.06 90 bottom
C7  26.67,48.73 180 top
C8  67.31,18.25 0 top
C9  67.31,22.06 180 top
C10  67.31,29.68 0 top
C11  36.83,30.95 0 bottom
C12  36.83,28.41 0 bottom
C13  146.69,42.38 270 bottom
C14  130.81,38.57 180 top
C15  144.78,32.22 270 bottom
C16  130.81,34.76 180 top
C17  72.39,43.65 90 top
C18  91.44,43.65 90 top
C19  73.66,19.52 270 top
C20  92.71,19.52 270 top
C21  77.47,60.16 0 top
C22  85.09,60.16 0 top
C23  85.09,79.21 0 top
C24  77.47,79.21 0 top
D1  143.51,91.91 0 top
DC1  134.62,80.48 90 top
DC2  134.62,72.86 90 top
IC1  52.07,34.76 0 top
IC2  55.88,11.9 270 top
IC3  82.55,51.27 270 top
IC4  38.1,48.73 0 top
IC5  138.43,32.22 90 bottom
J1  0,50 0 top
J2  138.43,41.11 180 top
JP1  29.21,27.14 270 top
LED1  -1.94,63 0 top
LED2  -1.94,71 0 top
LED3  -1.94,79 0 top
LED4  -1.94,87 0 top
OK1  120.65,33.49 90 top
OK2  120.65,46.19 270 top
OK3  120.65,18.25 90 top
OK4  120.65,24.6 90 top
Q1  39.37,29.68 270 top
R1  147.64,13.17 270 bottom
R2  157.48,68.41 90 bottom
R3  89.85,8.73 270 bottom
R4  152.4,69.05 180 bottom
R5  152.72,13.17 90 bottom
R6  146.37,69.05 270 bottom
R7  67.31,33.49 0 top
R8  24.13,29.68 0 bottom
R9  80.01,43.65 90 top
R10  83.82,43.65 90 top
R11  81.28,19.52 270 top
R12  85.09,19.52 270 top
R13  67.31,25.87 180 top
R14  76.2,43.65 270 top
R15  87.63,43.65 270 top
R16  77.47,19.52 90 top
R17  88.9,19.52 90 top
R18  77.47,56.35 0 top
R19  85.09,67.78 0 top
R20  77.47,63.97 180 top
R21  85.09,63.97 180 top
R22  85.09,71.59 0 top
R23  77.47,83.02 0 top
R24  85.09,75.4 180 top
R25  77.47,75.4 180 top
R26  24.13,24.6 0 bottom
R27  58.42,20.79 270 top
R28  53.34,20.79 270 top
R29  113.03,33.49 270 bottom
R30  129.54,30.32 270 bottom
R31  111.76,47.46 0 bottom
R32  128.27,46.19 90 bottom
R33  25.4,79.21 0 top
R34  7.62,57.62 90 bottom
R35  130.81,19.52 0 bottom
R36  10.16,81.75 90 bottom
R37  11.43,57.62 90 bottom
R38  130.81,23.33 0 bottom
R39  120.65,18.25 0 bottom
U1  17.78,30.95 90 top
VR1  77.47,27.14 0 top

### Tracks (layer width: path | path; a pad name or v marks a point on that pad's centre or on a via)
3V3
  Bottom 0.406: IC5.17 144.4,35.14 144.78,34.76 C15.1
!RST
  Top 0.305: U1.4 22.86,29.68 25.4,27.14 JP1.2
+5V  (via drill 0.6)
  Top 0.305: IC1.5 48.11,35.56 v48.26,35.71 | v52.7,38.25 52.87,38.42 IC1.38 | v51.12,31.59 52.07,30.63 IC1.17 52.07,27.77 50.8,26.5 50.8,20.79 52.25,19.34 R28.2 R27.2 58.42,18.25 | R19.2 R22.2 v90.17,71.59 | IC4.4 32.15,49.13 v32.07,49.05 | v32.07,49.05 32.07,47.78 32.31,47.53 IC4.6 37.71,47.53 38.51,46.73 IC4.18 | 58.42,18.25 58.42,14.06 IC2.8 | C7.1 31.75,48.73 v32.07,49.05 | v71.12,33.49 R7.2 | 58.42,18.25 C8.1
  Top 0.406: 5.08,64.27 8.59,64.27 13.97,58.89 13.97,28.41 15.24,27.14 U1.5 | 5.08,64.27 LED1.A | C5.1 148.35,85.56 J1.C2 | LED2.A 4.4,72.27 5.08,71.59 5.08,64.27
  Top 0.61: DC1.6 140.97,79.21 138.43,76.67 95.25,76.67 v90.17,71.59 | IC3.8 87,53.17 v87.63,53.81
  Top 1.5: J1.C32 152.16,13.17 156.21,13.17 157.48,14.44 157.48,32.22 158.75,33.49 158.75,43.33 157.48,44.6 v157.48,71.27 157.48,83.02 156.21,84.29 152.16,84.29 J1.C2
  Bottom 0.305: R8.2 22.68,27.14 | 22.68,27.14 R26.2 | 22.68,27.14 U1.5 | 55.88,33.49 v71.12,33.49
  Bottom 0.406: R29.2 113.21,32.22 OK1.7 OK1.8 | R1.2 148.13,11.72 149.22,10.63 J1.C32 | 110.31,33.67 C3.1 | v157.48,71.27 R2.2 | 10.16,71.59 C4.1 | 55.24,38.57 C6.1 | LED4.A 9.99,88.27 13.97,84.29 13.97,71.59
  Bottom 0.61: DC1.6 140.97,78.58 140.02,77.62 136.53,77.62 133.35,74.45 133.35,70.32 132.08,69.05 111.76,69.05 110.31,67.6 R31.2 110.31,33.67 111.94,32.04 R29.2 | 55.88,37.3 71.12,37.3 v87.63,53.81 90.17,56.35 v90.17,71.59 32.07,71.59 | 32.07,71.59 13.97,71.59 10.16,71.59 8.89,71.59 8.21,72.27 LED2.A | 32.07,71.59 v32.07,49.05
  Bottom 1.5: J1.C2 146.05,86.83 140.97,81.75 DC1.6
  pour Bottom: 47.62,38.89 55.88,38.89 55.88,30.63 48.9,30.63 47.62,31.9
+5V_AD
  Top 0.305: IC1.27 63.03,33.96 63.5,33.49 R7.1 C10.1 R13.2
+12V
  Top 0.305: DC2.6 140.97,63.97 137.16,60.16 96.52,60.16 92.71,56.35 R18.2
  Bottom 0.813: J1.A4 152.16,79.21 148.59,79.21 142.24,72.86 DC2.6
+24V
  Top 1.5: C1.+ D1.C
  Bottom 0.406: C2.1 DC2.1
  Bottom 1.5: C1.+ 132.08,91.91 128.27,88.1 DC1.1 DC2.1
-12V
  Top 0.406: R21.1 134.62,63.97 135.89,65.24 DC2.4
  Bottom 0.813: DC2.4 135.89,74.45 137.16,75.72 141.6,75.72 147.32,81.75 J1.C4
BUS_A  (via drill 0.6)
  Top 0.305: v74.3,10.63 82.55,10.63 85.09,13.17 R12.2
  Top 0.406: IC2.6 73.66,11.27 v74.3,10.63
  Bottom 0.406: J1.C30 148.53,14.62 R1.1 147.46,14.44 145.41,14.44 139.06,8.09 89.85,8.09 | 89.85,8.09 76.83,8.09 v74.3,10.63 | 89.85,8.09 R3.2
BUS_B  (via drill 0.6)
  Top 0.305: v73.66,13.17 80.19,13.17 81.28,14.26 R11.2
  Top 0.406: IC2.7 73.03,12.53 v73.66,13.17
  Bottom 0.406: R5.2 153.61,14.62 J1.A30 152.16,18.25 147,18.25 138.11,9.36 89.85,9.36 | 89.85,9.36 77.47,9.36 v73.66,13.17 | 89.85,9.36 R3.1
BUS_EXT_A  (via drill 0.6)
  Top 0.305: v115.57,56.35 109.86,50.63 IC3.6 84.45,50.63 83.82,50 R10.2
  Bottom 0.305: J1.A10 152.16,63.97 123.19,63.97 v115.57,56.35
  Bottom 0.406: R2.1 155.16,66.97 J1.A10 153.85,67.36 R4.2
BUS_EXT_B  (via drill 0.6)
  Top 0.305: v113.03,56.35 108.58,51.91 IC3.7 83.19,51.91 82.23,50.95 82.23,47.14 80.19,45.1 R9.2
  Bottom 0.305: v113.03,56.35 123.19,66.51 146.37,66.51 | 146.37,66.51 J1.C10 | 146.37,66.51 R6.2
  Bottom 0.406: J1.C10 150.95,67.84 R4.1
CLK  (via drill 0.6)
  Top 0.305: IC1.7 41.24,33.96 Q1.1 | IC4.7 32.29,46.73 31.75,46.19 31.75,42.38 v34.29,39.84
  Bottom 0.305: C11.1 38.23,30.95 Q1.1 37.97,33.49 35.56,33.49 34.29,34.76 v34.29,39.84
EXT_RXD  (via drill 0.6)
  Top 0.305: IC4.30 36.9,58.82 v36.83,58.89 | IC3.1 78.11,53.17 v77.47,52.54
  Bottom 0.305: v36.83,58.89 37.47,58.26 52.39,58.26 58.74,51.91 74.93,51.91 75.56,52.54 v77.47,52.54
EXT_TE  (via drill 0.6)
  Top 0.305: 79.75,51.27 IC3.3 | 79.75,51.27 IC3.2 | IC4.32 35.3,55.34 34.61,56.03 34.61,57.3 v34.92,57.62 | v76.2,51.27 79.75,51.27
  Bottom 0.305: v76.2,51.27 58.42,51.27 52.07,57.62 v34.92,57.62
EXT_TXD  (via drill 0.6)
  Top 0.305: IC4.31 36.1,56.13 v35.88,56.35 | IC3.4 78.11,49.37 v77.47,50
  Bottom 0.305: v35.88,56.35 36.51,56.98 51.75,56.98 58.1,50.63 74.93,50.63 75.56,50 v77.47,50
GND  (via drill 0.6)
  Top 0.305: 34.29,44.92 35.24,45.87
  other vias: 52.39,43.65 3.81,13.17 77.47,26.82 55.88,20.79 39.37,48.73 77.47,32.22 12.38,81.75
  pour Bottom (rank 2): 0,-0.8 161.29,-0.8 161.29,100.8 0,100.8
  pour Top (rank 2): 0,100.8 161.29,100.8 161.29,-0.8 0,-0.8
GNDINT
  Bottom 0.406: 143.78,34.49 IC5.18 141.02,34.49 | IC5.26 143.58,29.3 | 133.68,31.89 IC5.7 | 143.82,32.55 IC5.21 140.33,32.55 | 142.06,29.93 143.58,29.93
  pour Bottom: 121.92,14.44 121.92,52.54 143.51,52.54 143.51,43.38 arc90 144.51,42.38 151.13,42.38 151.13,24.6 140.7,24.6 arc90 137.16,21.06 137.16,14.44
  pour Top: 121.92,52.54 143.51,52.54 143.51,43.65 arc106 144.78,42.38 149.86,42.38 149.86,24.6 140.97,24.6 arc91 137.16,20.79 137.16,14.44 121.92,14.44
I2C_SCL  (via drill 0.6)
  Top 0.305: IC1.19 53.67,27.47 53.34,27.14 53.34,26.19 | IC4.28 38.5,50.72 v38.1,50.32 | 53.34,26.19 R28.1 | v52.39,26.19 53.34,26.19
  Bottom 0.305: v38.1,50.32 38.1,50.95 39.69,52.54 41.91,52.54 46.35,48.09 46.35,40.79 43.18,37.62 43.18,29.68 46.99,25.87 52.07,25.87 v52.39,26.19
I2C_SDA  (via drill 0.6)
  Top 0.305: IC4.27 39.3,51.66 v40.32,50.63 | IC1.20 54.47,27.28 56.99,24.76 | 56.99,24.76 58.42,23.33 R27.1 | v56.52,24.28 56.99,24.76 | 56.99,24.76
  Bottom 0.305: v56.52,24.28 46.35,24.28 41.59,29.05 41.59,38.25 44.77,41.43 44.77,46.19 v40.32,50.63
IPC_1
  Top 0.305: IC4.23 44.99,50.73 48.87,46.85 IC1.43
IPC_2
  Top 0.305: IC4.24 45.46,51.53 49.67,47.32 IC1.42
IPC_3
  Top 0.305: IC4.25 45.24,53.02 50.47,47.79 IC1.41
LED_ERR
  Top 0.406: R33.2 31.75,79.21 51.27,59.69 IC1.40
N$1
  Bottom 0.406: LED4.K 7.63,85.73 R36.2
N$2
  Top 0.305: IC1.8 42.85,33.16 39.37,29.68 Q1.2
  Bottom 0.305: C12.1 38.23,28.41 Q1.2
N$3
  Bottom 0.305: IC5.22 140.65,31.89 140.02,31.27 140.02,28.41 134.94,23.33 R38.1
N$6
  Bottom 0.305: OK4.2 127,25.87 129.36,23.51 R38.2
N$7
  Bottom 0.305: OK3.2 R35.2
N$9
  Top 0.406: LED3.A 22.89,80.27 R33.1
N$13
  Bottom 0.406: R31.1 OK2.2
N$16  (via drill 0.6)
  Top 0.406: OK4.4 110.49,23.33 109.22,22.06 109.22,9.36 107.95,8.09 v60.96,8.09
  Bottom 0.406: v60.96,8.09 16.51,8.09 11.43,13.17 R37.1
N$17
  Bottom 0.406: LED2.K 8.21,69.73 11.43,66.51 R37.2
N$21
  Bottom 0.406: OK1.2 129.09,32.22 R30.1
N$23  (via drill 0.6)
  Top 0.406: OK3.4 113.03,16.98 111.76,15.71 111.76,6.82 110.49,5.55 v64.77,5.55
  Bottom 0.406: v64.77,5.55 13.97,5.55 7.62,11.9 R34.1
N$24
  Bottom 0.305: IC5.23 140.95,31.25 140.65,30.95 140.65,28.09 132.26,19.7 R35.1
N$26
  Bottom 0.406: LED1.K 6.05,61.73 7.62,60.16 R34.2
P1_!RST
  Top 0.305: IC1.4 39.7,36.36 33.02,29.68 JP1.1
  Bottom 0.305: R8.1 JP1.1
P2_!RST  (via drill 0.6)
  Top 0.305: IC4.29 37.7,54.68 v38.1,55.08
  Bottom 0.305: R26.1 JP1.3 31.11,24.6 32.07,25.55 32.07,30.63 30.48,32.22 30.48,42.38 35.56,47.46 35.56,52.54 v38.1,55.08
P_MISO  (via drill 0.6)
  Top 0.305: IC1.2 38.76,37.96 36.51,35.71 | 36.51,35.71 35.56,34.76 U1.2 | 36.51,35.71 v36.2,36.03 | IC4.16 40.9,43.39 v42.23,42.06
  Bottom 0.305: v42.23,42.06 39.05,42.06 36.2,39.2 v36.2,36.03
P_MOSI
  Top 0.305: U1.1 36.83,37.3 38.29,38.76 40.01,38.76 | 40.01,38.76 IC1.1 | IC4.15 40.1,38.86 40.01,38.76
P_SCK  (via drill 0.6)
  Top 0.305: IC1.3 39.23,37.16 34.29,32.22 v33.02,32.22 U1.3 | IC4.17 42.39,44.44 v42.55,44.28
  Bottom 0.305: v42.55,44.28 36.2,44.28 33.02,41.11 v33.02,32.22
RS_RXD  (via drill 0.6)
  Top 0.305: v51.12,13.8 IC2.1 | IC1.11 46.27,14.21 v46.67,13.8
  Bottom 0.305: v46.67,13.8 v51.12,13.8
RS_TXD
  Top 0.305: IC2.4 51.44,9.99 48.07,13.36 IC1.12
RS_W!R!
  Top 0.305: IC2.2 49.85,12.53 48.87,13.51 IC1.13
  Top 0.406: IC2.3 IC2.2
RXD1
  Bottom 0.406: OK2.6 128.09,44.92 R32.1 128.27,42.2 131.58,38.89 134.62,38.89 137.16,36.35 137.16,30.95 136.81,30.59 IC5.5
RXD2  (via drill 0.6)
  Top 0.305: OK2.3 111.76,44.92 v107.31,40.48 | IC1.10 44.79,31.56 v44.45,31.9
  Bottom 0.305: v44.45,31.9 48.26,28.09 94.93,28.09 v107.31,40.48
SENSE_5
  Top 0.305: IC1.36 54.47,58.75 67.31,71.59 R22.1 R24.2 C23.1
SENSE_24
  Top 0.305: IC1.37 53.67,59.22 73.66,79.21 C24.1 | C24.1 R25.2 | C24.1 R23.1
SENSE_+12
  Top 0.305: IC1.34 56.07,57.81 58.42,60.16 C21.1 | C21.1 R18.1 | C21.1 R20.2
SENSE_-12
  Top 0.305: IC1.35 55.27,58.28 64.77,67.78 R19.1 R21.2 C22.1
SENSE_A
  Top 0.305: IC1.31 76.34,37.16 85.09,28.41 R12.1 R17.2 C20.1
SENSE_B
  Top 0.305: IC1.30 75.87,36.36 81.28,30.95 R11.1 R16.2 C19.1
SENSE_EXT_A
  Top 0.305: IC1.32 81.94,37.96 83.82,39.84 R10.1 R15.2 C18.1
SENSE_EXT_B
  Top 0.305: R14.2 R9.1 | R14.2 76.2,40.16 74.8,38.76 IC1.33 | R14.2 C17.1
TXD1
  Bottom 0.406: IC5.1 133.45,28 132.72,28.73 132.72,31.9 129.86,34.76 OK1.3
TXD2  (via drill 0.6)
  Top 0.305: OK1.6 99.06,34.76 v97.79,33.49 | IC1.9 47.48,32.36 48.58,31.27 v48.58,30.95
  Bottom 0.305: v48.58,30.95 49.85,29.68 93.98,29.68 v97.79,33.49
  Bottom 0.406: R29.1 113.21,34.76 OK1.6
USBDM
  Bottom 0.406: IC5.16 149.38,35.8 J1.C22
USBDP
  Bottom 0.406: J1.A22 154.7,36.27 152.72,38.25 148.27,38.25 146.47,36.45 IC5.15
V+
  Top 0.305: R23.2 110.49,83.02 123.19,95.72 143.83,95.72 147.21,92.34 D1.A
  Top 1.5: D1.A 149.62,91.91 J1.A2
  Bottom 1.5: J1.A2 156.21,86.83 157.8,85.24 157.8,74.69 J1.A8
V_REF
  Top 0.305: IC1.29 74.45,35.56 75.56,34.44 VR1.8 | 75.56,25.87 R13.1 C9.1
  Top 0.406: VR1.8 75.56,25.87 VR1.1
VCCINT
  Top 0.305: OK3.1 128.27,16.98 129.54,18.25 129.54,22.06 128.27,23.33 | 128.27,23.33 OK4.1 | 128.27,23.33 133.35,28.41 133.35,34.76 C16.1
  Top 0.406: 133.35,38.57 J2.2 | 133.35,38.57 C14.1 | 133.35,34.76 133.35,38.57
  Bottom 0.406: 137.16,29.95 IC5.4 | 137.16,29.95 138.06,29.95 138.43,30.32 138.43,32.22 139.41,33.2 140.04,33.2 | 140.04,33.2 IC5.20 | 128.27,47.46 OK2.7 OK2.8 | 128.27,47.46 R32.2 | J2.2 133.99,41.11 | 133.99,41.11 134.01,41.13 | J1.A20 152.48,43.33 C13.1 145.73,43.33 J2.1 133.99,41.11 | 128.27,47.46 130.81,47.46 133.35,44.92 J2.2 | 140.04,33.2 140.04,34.74 134.94,39.84 134.62,39.84 J2.2 | R30.2 131.26,27.14 135.89,27.14 137.16,28.41 137.16,29.95

### Text on the board
Top: V-00489-01 / LIC_rack_ZM / Lukas Novak / 30.07.2015